# Altium schematic sheet FPGA.SchDoc
size Tabloid; SheetNumber: 2; SheetTotal: 5; Sheet_Name: FPGA Connectors; Size: 11x17
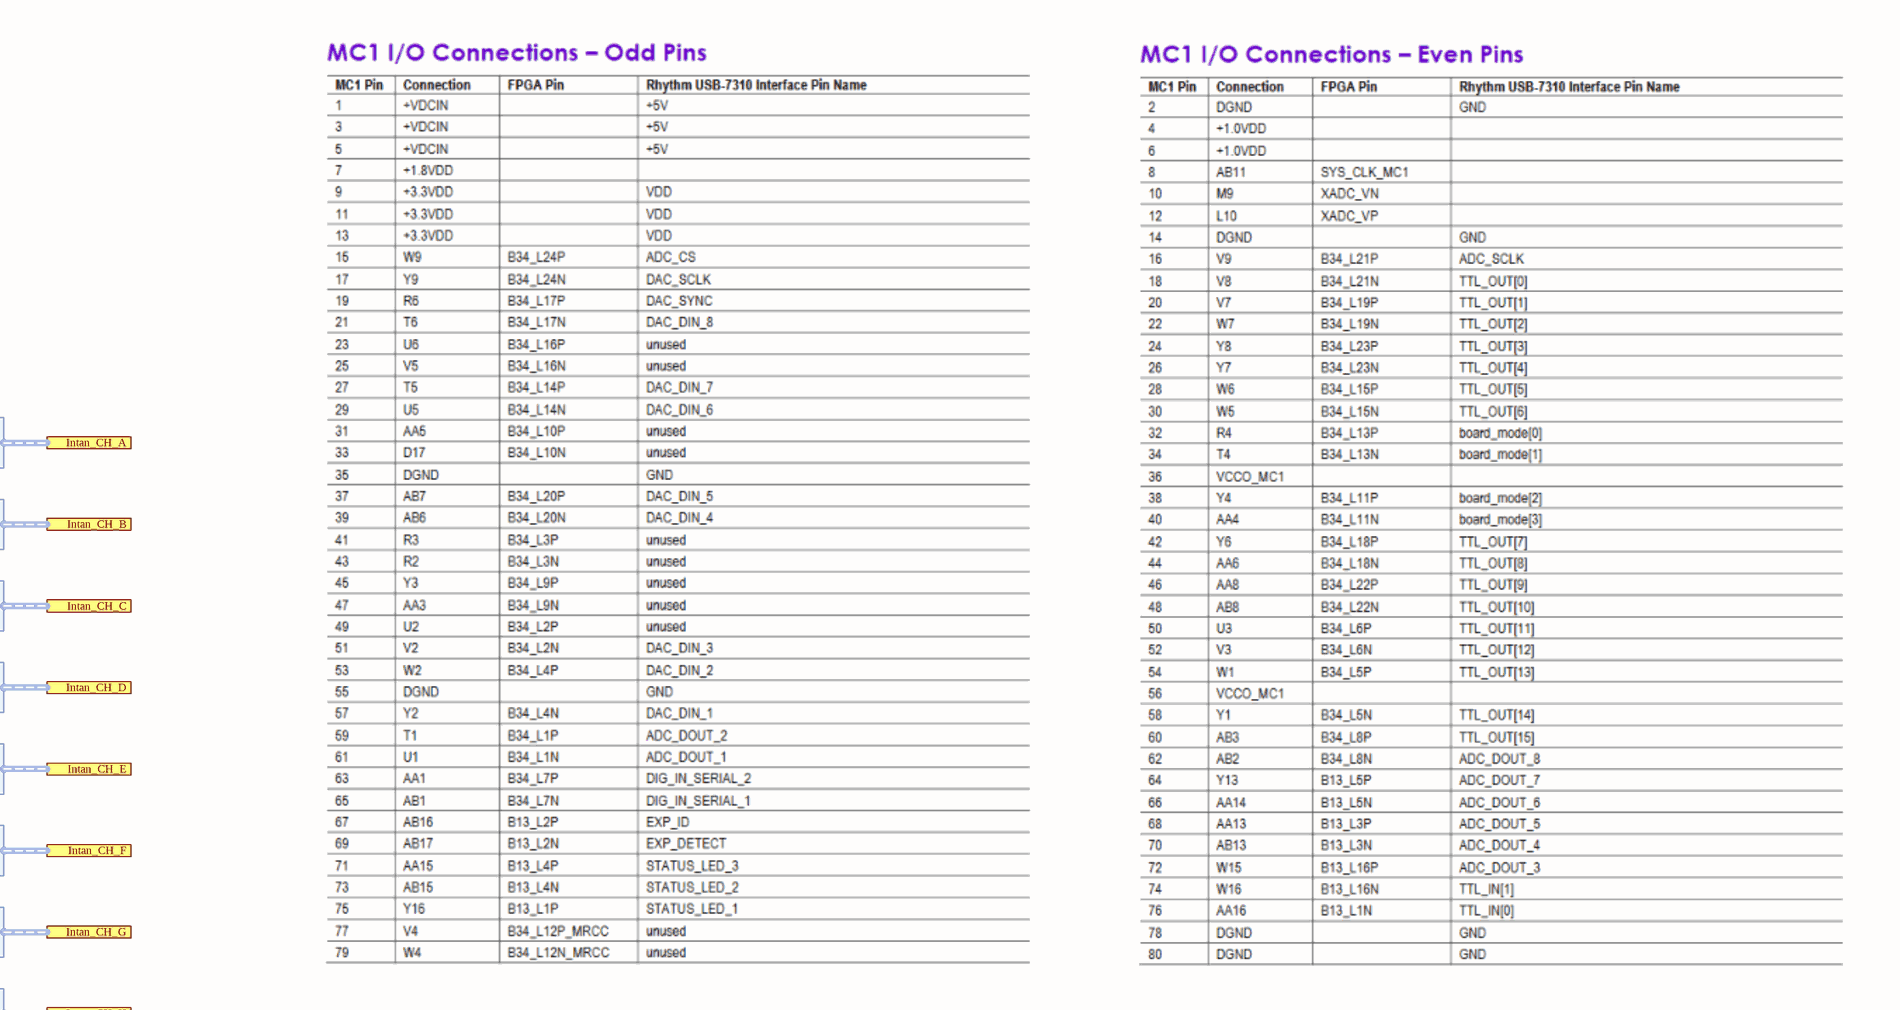
[diagram p0: FPGA.SchDoc, top right]
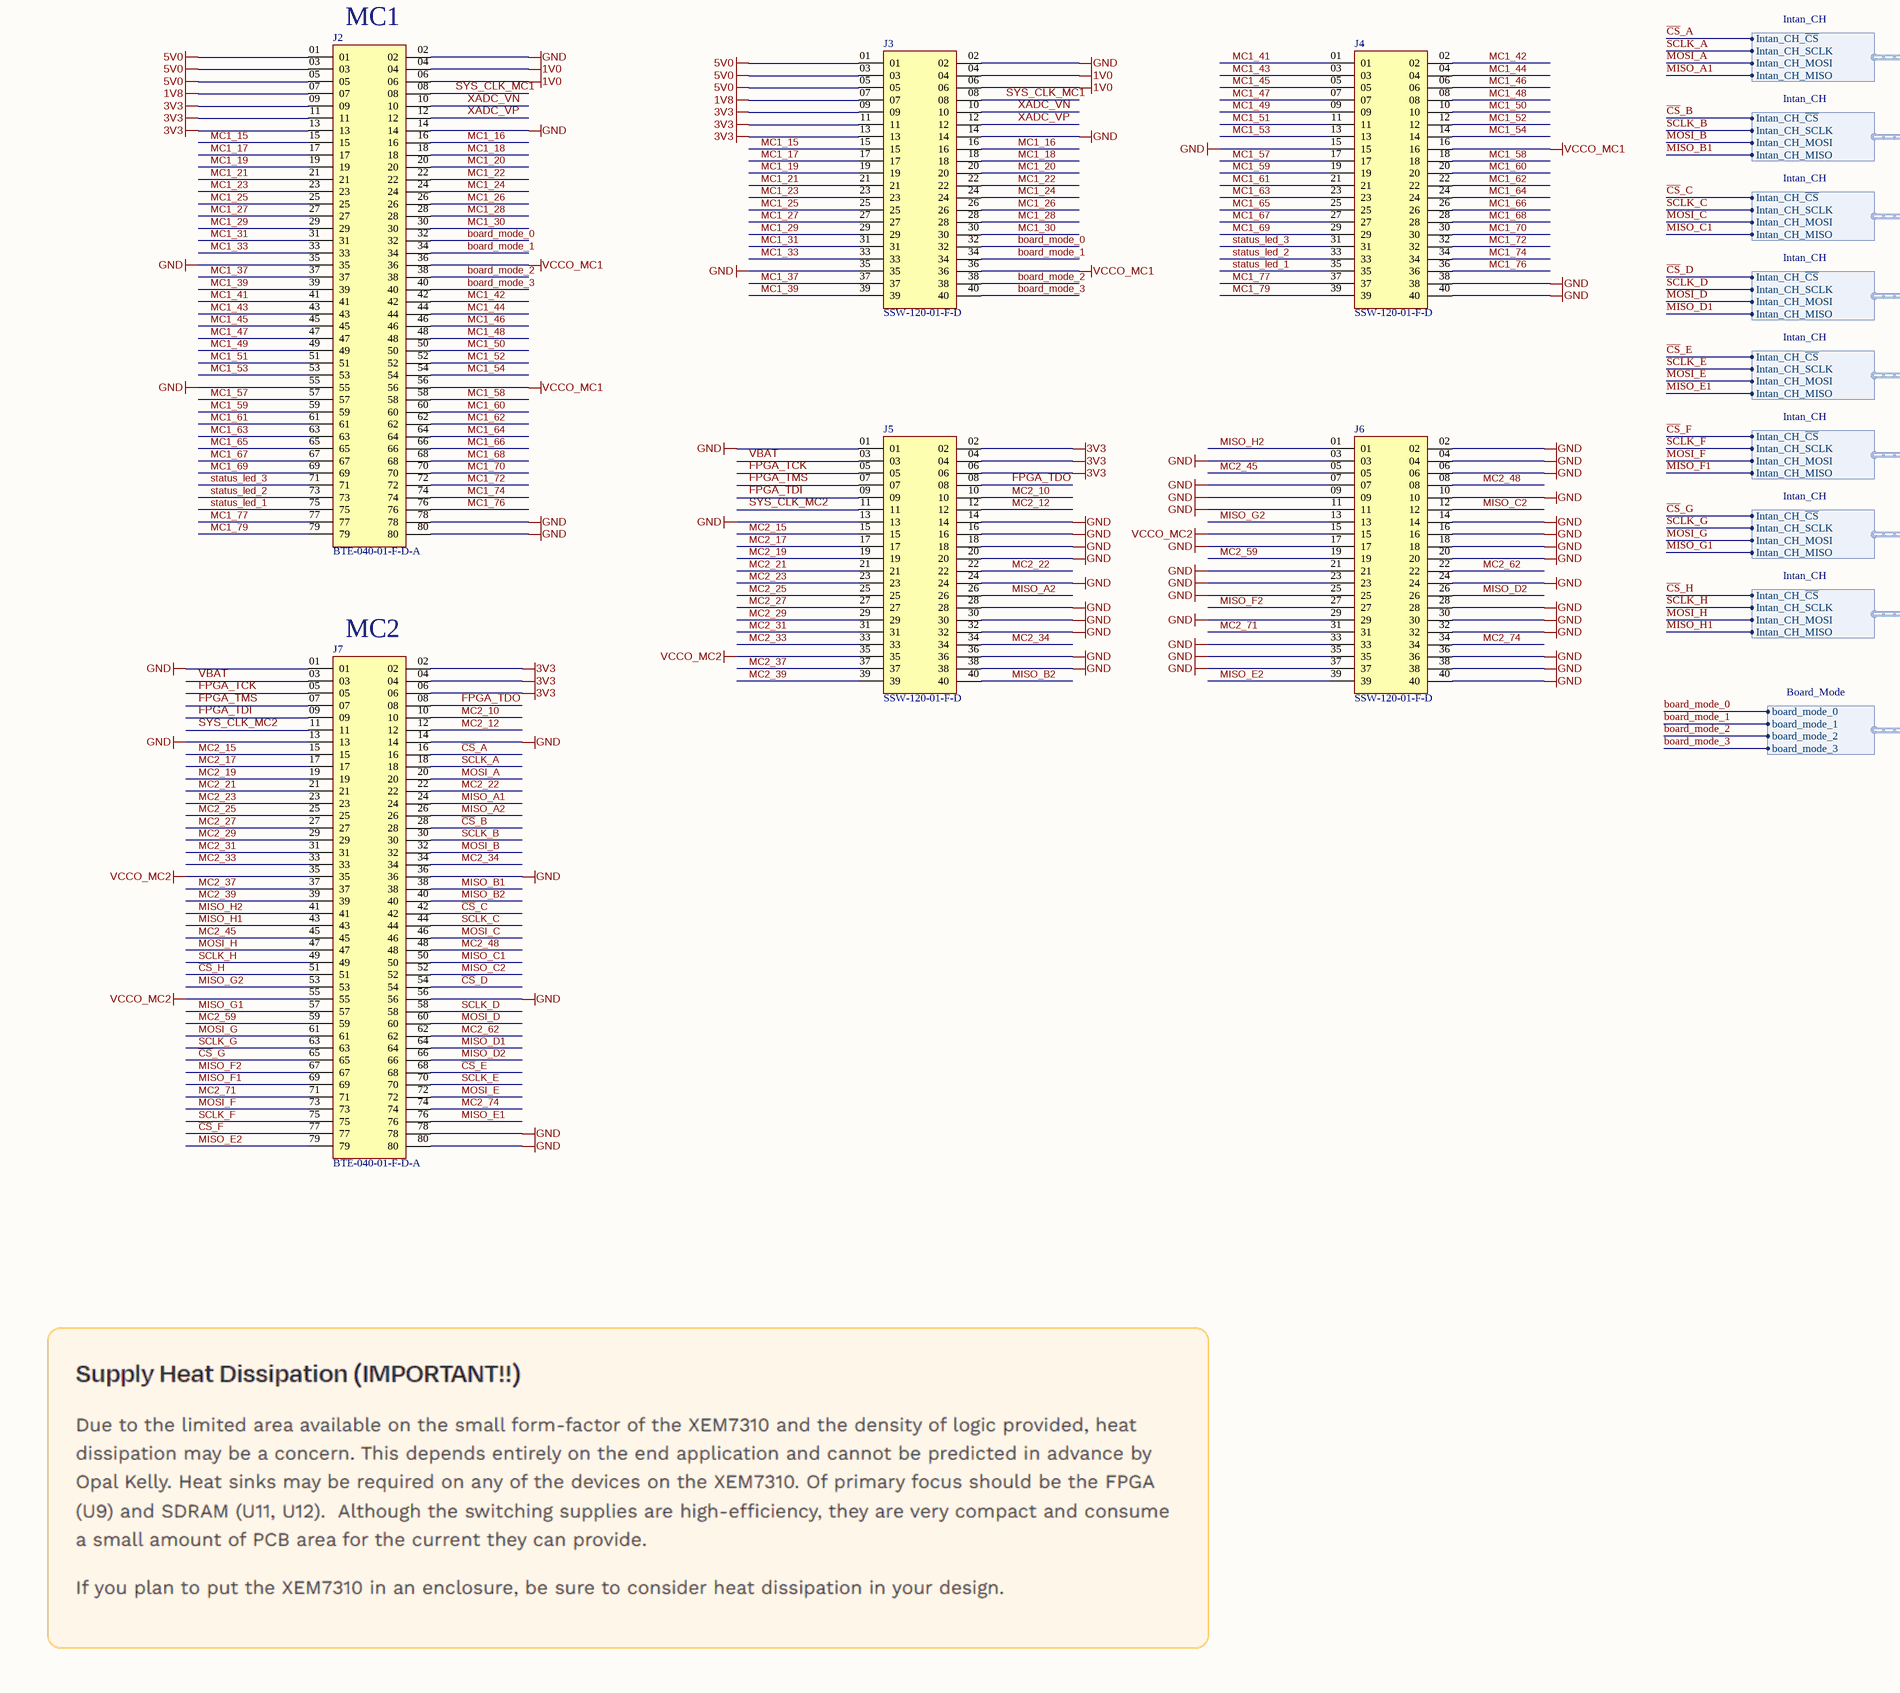
[diagram p1: FPGA.SchDoc, bottom left]
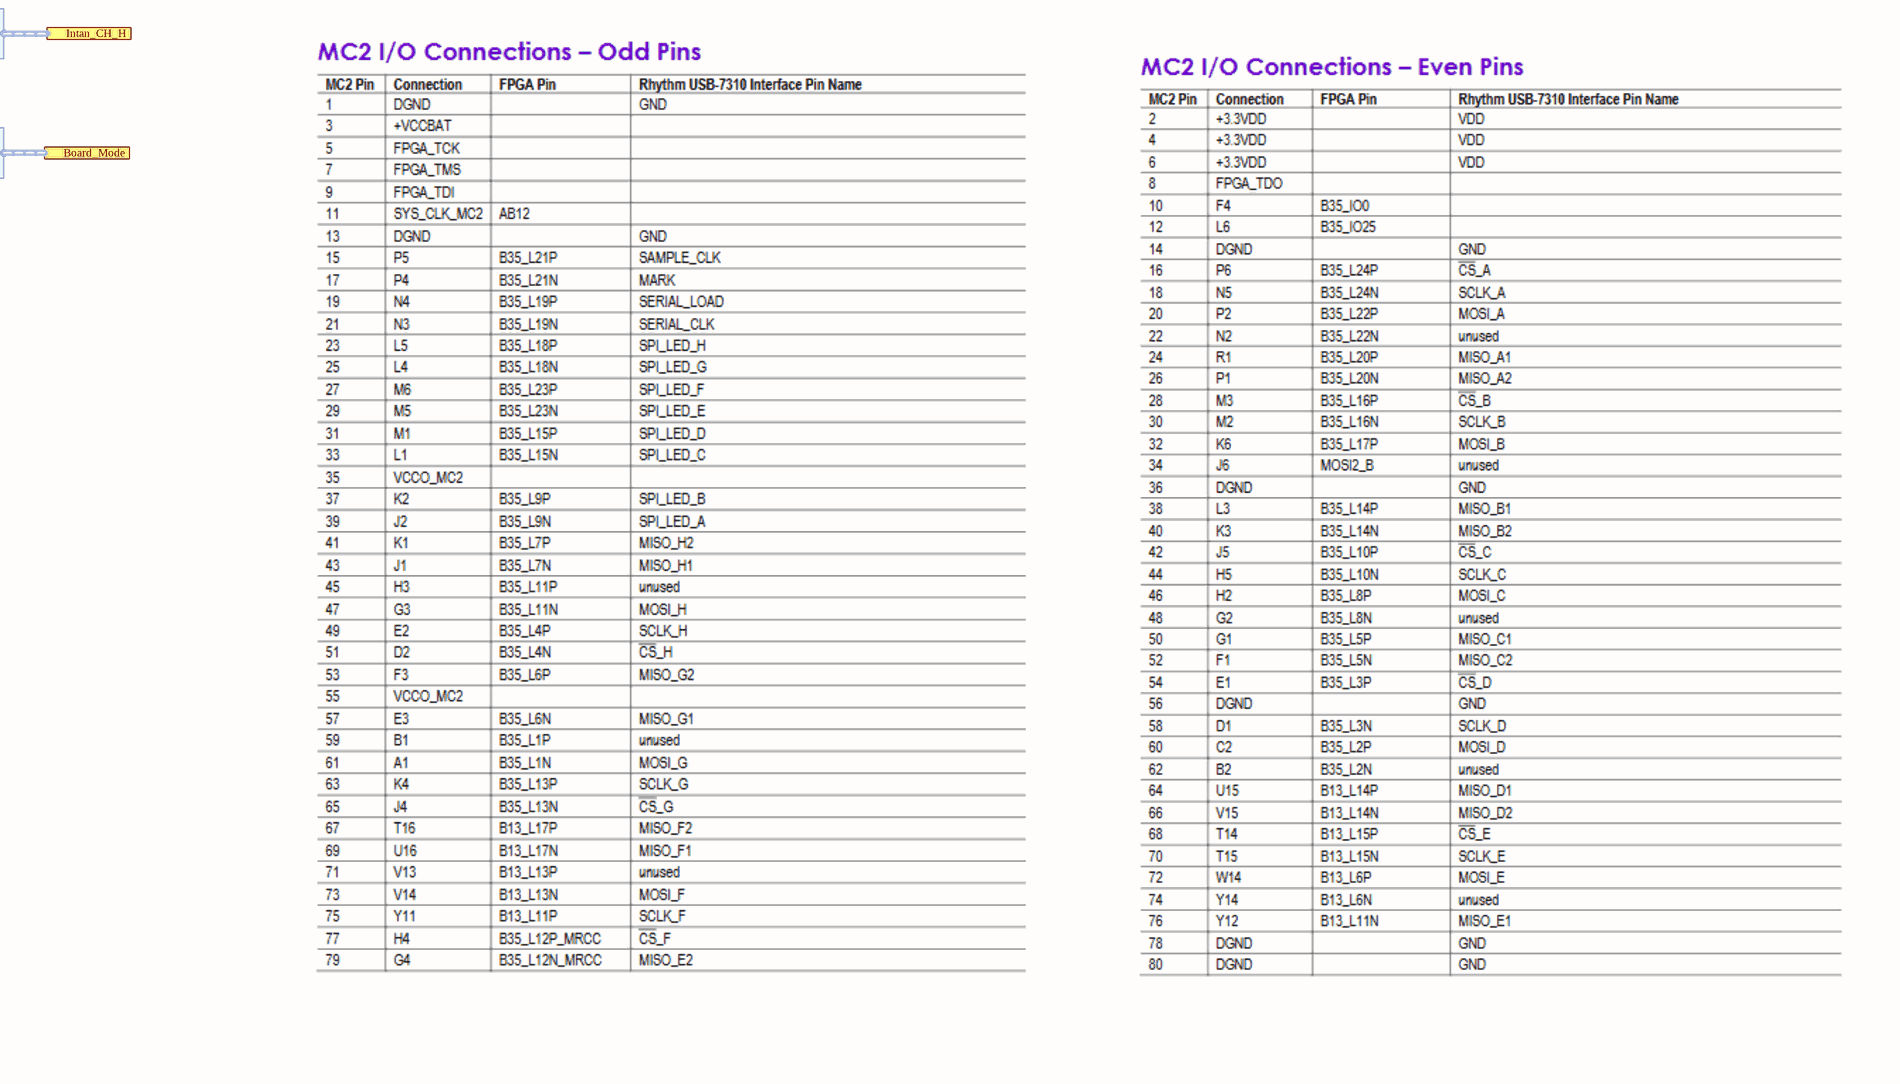
[diagram p2: FPGA.SchDoc, bottom right]

## Parts
J2  BTE-040-01-F-D-A  [SAMTEC_BTE-040-01-F-D-A]
J3  SSW-120-01-F-D  [SAMTEC_SSW-120-01-F-D]
J4  SSW-120-01-F-D  [SAMTEC_SSW-120-01-F-D]
J5  SSW-120-01-F-D  [SAMTEC_SSW-120-01-F-D]
J6  SSW-120-01-F-D  [SAMTEC_SSW-120-01-F-D]
J7  BTE-040-01-F-D-A  [SAMTEC_BTE-040-01-F-D-A]

## Ports
Board_Mode (harness Board_Mode), Intan_CH_A (harness Intan_CH), Intan_CH_B (harness Intan_CH), Intan_CH_C (harness Intan_CH), Intan_CH_D (harness Intan_CH), Intan_CH_E (harness Intan_CH), Intan_CH_F (harness Intan_CH), Intan_CH_G (harness Intan_CH), Intan_CH_H (harness Intan_CH)

## Harnesses
Board_Mode: board_mode_0, board_mode_1, board_mode_2, board_mode_3
Intan_CH: Intan_CH_~{CS}, Intan_CH_SCLK, Intan_CH_MOSI, Intan_CH_MISO

## Nets
1V0: J2.04 J2.06 J3.04 J3.06
1V8: J2.07 J3.07
3V3: J2.09 J2.11 J2.13 J3.09 J3.11 J3.13 J5.02 J5.04 J5.06 J7.02 J7.04 J7.06
5V0: J2.01 J2.03 J2.05 J3.01 J3.03 J3.05
GND: J2.02 J2.14 J2.35 J2.55 J2.78 J2.80 J3.02 J3.14 J3.35 J4.15 J4.38 J4.40 J5.01 J5.13 J5.14 J5.16 J5.18 J5.20 J5.24 J5.28 J5.30 J5.32 J5.36 J5.38 J6.02 J6.03 J6.04 J6.06 J6.07 J6.09 J6.10 J6.11 J6.14 J6.16 J6.17 J6.18 J6.20 J6.21 J6.23 J6.24 J6.25 J6.28 J6.29 J6.30 J6.32 J6.33 J6.35 J6.36 J6.37 J6.38 J6.40 J7.01 J7.13 J7.14 J7.36 J7.56 J7.78 J7.80
VCCO_MC1: J2.36 J2.56 J3.36 J4.16
VCCO_MC2: J5.35 J6.15 J7.35 J7.55
board_mode_0: J2.32 J3.32 ; port Board_Mode.board_mode_0
board_mode_1: J2.34 J3.34 ; port Board_Mode.board_mode_1
board_mode_2: J2.38 J3.38 ; port Board_Mode.board_mode_2
board_mode_3: J2.40 J3.40 ; port Board_Mode.board_mode_3
~{CS}_A: J7.16 ; port Intan_CH_A.Intan_CH_~{CS}
~{CS}_B: J7.28 ; port Intan_CH_B.Intan_CH_~{CS}
~{CS}_C: J7.42 ; port Intan_CH_C.Intan_CH_~{CS}
~{CS}_D: J7.54 ; port Intan_CH_D.Intan_CH_~{CS}
~{CS}_E: J7.68 ; port Intan_CH_E.Intan_CH_~{CS}
~{CS}_F: J7.77 ; port Intan_CH_F.Intan_CH_~{CS}
~{CS}_G: J7.65 ; port Intan_CH_G.Intan_CH_~{CS}
~{CS}_H: J7.51 ; port Intan_CH_H.Intan_CH_~{CS}
FPGA_TCK: J5.05 J7.05
FPGA_TDI: J5.09 J7.09
FPGA_TDO: J5.08 J7.08
FPGA_TMS: J5.07 J7.07
MC1_15: J2.15 J3.15
MC1_16: J2.16 J3.16
MC1_17: J2.17 J3.17
MC1_18: J2.18 J3.18
MC1_19: J2.19 J3.19
MC1_20: J2.20 J3.20
MC1_21: J2.21 J3.21
MC1_22: J2.22 J3.22
MC1_23: J2.23 J3.23
MC1_24: J2.24 J3.24
MC1_25: J2.25 J3.25
MC1_26: J2.26 J3.26
MC1_27: J2.27 J3.27
MC1_28: J2.28 J3.28
MC1_29: J2.29 J3.29
MC1_30: J2.30 J3.30
MC1_31: J2.31 J3.31
MC1_33: J2.33 J3.33
MC1_37: J2.37 J3.37
MC1_39: J2.39 J3.39
MC1_41: J2.41 J4.01
MC1_42: J2.42 J4.02
MC1_43: J2.43 J4.03
MC1_44: J2.44 J4.04
MC1_45: J2.45 J4.05
MC1_46: J2.46 J4.06
MC1_47: J2.47 J4.07
MC1_48: J2.48 J4.08
MC1_49: J2.49 J4.09
MC1_50: J2.50 J4.10
MC1_51: J2.51 J4.11
MC1_52: J2.52 J4.12
MC1_53: J2.53 J4.13
MC1_54: J2.54 J4.14
MC1_57: J2.57 J4.17
MC1_58: J2.58 J4.18
MC1_59: J2.59 J4.19
MC1_60: J2.60 J4.20
MC1_61: J2.61 J4.21
MC1_62: J2.62 J4.22
MC1_63: J2.63 J4.23
MC1_64: J2.64 J4.24
MC1_65: J2.65 J4.25
MC1_66: J2.66 J4.26
MC1_67: J2.67 J4.27
MC1_68: J2.68 J4.28
MC1_69: J2.69 J4.29
MC1_70: J2.70 J4.30
MC1_72: J2.72 J4.32
MC1_74: J2.74 J4.34
MC1_76: J2.76 J4.36
MC1_77: J2.77 J4.37
MC1_79: J2.79 J4.39
MC2_10: J5.10 J7.10
MC2_12: J5.12 J7.12
MC2_15: J5.15 J7.15
MC2_17: J5.17 J7.17
MC2_19: J5.19 J7.19
MC2_21: J5.21 J7.21
MC2_22: J5.22 J7.22
MC2_23: J5.23 J7.23
MC2_25: J5.25 J7.25
MC2_27: J5.27 J7.27
MC2_29: J5.29 J7.29
MC2_31: J5.31 J7.31
MC2_33: J5.33 J7.33
MC2_34: J5.34 J7.34
MC2_37: J5.37 J7.37
MC2_39: J5.39 J7.39
MC2_45: J6.05 J7.45
MC2_48: J6.08 J7.48
MC2_59: J6.19 J7.59
MC2_62: J6.22 J7.62
MC2_71: J6.31 J7.71
MC2_74: J6.34 J7.74
MISO_A1: J7.24 ; port Intan_CH_A.Intan_CH_MISO
MISO_A2: J5.26 J7.26
MISO_B1: J7.38 ; port Intan_CH_B.Intan_CH_MISO
MISO_B2: J5.40 J7.40
MISO_C1: J7.50 ; port Intan_CH_C.Intan_CH_MISO
MISO_C2: J6.12 J7.52
MISO_D1: J7.64 ; port Intan_CH_D.Intan_CH_MISO
MISO_D2: J6.26 J7.66
MISO_E1: J7.76 ; port Intan_CH_E.Intan_CH_MISO
MISO_E2: J6.39 J7.79
MISO_F1: J7.69 ; port Intan_CH_F.Intan_CH_MISO
MISO_F2: J6.27 J7.67
MISO_G1: J7.57 ; port Intan_CH_G.Intan_CH_MISO
MISO_G2: J6.13 J7.53
MISO_H1: J7.43 ; port Intan_CH_H.Intan_CH_MISO
MISO_H2: J6.01 J7.41
MOSI_A: J7.20 ; port Intan_CH_A.Intan_CH_MOSI
MOSI_B: J7.32 ; port Intan_CH_B.Intan_CH_MOSI
MOSI_C: J7.46 ; port Intan_CH_C.Intan_CH_MOSI
MOSI_D: J7.60 ; port Intan_CH_D.Intan_CH_MOSI
MOSI_E: J7.72 ; port Intan_CH_E.Intan_CH_MOSI
MOSI_F: J7.73 ; port Intan_CH_F.Intan_CH_MOSI
MOSI_G: J7.61 ; port Intan_CH_G.Intan_CH_MOSI
MOSI_H: J7.47 ; port Intan_CH_H.Intan_CH_MOSI
SCLK_A: J7.18 ; port Intan_CH_A.Intan_CH_SCLK
SCLK_B: J7.30 ; port Intan_CH_B.Intan_CH_SCLK
SCLK_C: J7.44 ; port Intan_CH_C.Intan_CH_SCLK
SCLK_D: J7.58 ; port Intan_CH_D.Intan_CH_SCLK
SCLK_E: J7.70 ; port Intan_CH_E.Intan_CH_SCLK
SCLK_F: J7.75 ; port Intan_CH_F.Intan_CH_SCLK
SCLK_G: J7.63 ; port Intan_CH_G.Intan_CH_SCLK
SCLK_H: J7.49 ; port Intan_CH_H.Intan_CH_SCLK
status_led_1: J2.75 J4.35
status_led_2: J2.73 J4.33
status_led_3: J2.71 J4.31
SYS_CLK_MC1: J2.08 J3.08
SYS_CLK_MC2: J5.11 J7.11
VBAT: J5.03 J7.03
XADC_VN: J2.10 J3.10
XADC_VP: J2.12 J3.12

## Notes on the sheet
- (near J2) MC1
- (near J7) MC2
- Sheet Name
- Project Title
- Global Project
- Size
- Group
- Revision
- Date
- Sheet
- of
- Filename
- Designers

## Library data of the parts
J2 J7 = CON_FPGA_SMD: 80 Position Connector Header, Outer Shroud Contacts Surface Mount Gold; MF: Samtec; MP: BTE-040-01-F-D-A; Value: *; Package: None; Price: None; Availability: Unavailable
J3-J6 = CON_HEADF_2X20: 40 Position Receptacle Connector 0.100" (2.54mm) Through Hole Gold; MF: Samtec; Package: None; Availability: Unavailable; Value: *; MP: SSW-120-01-F-D; Price: None